# EAGLE design encoder with leds v1 (EAGLE 5.02)
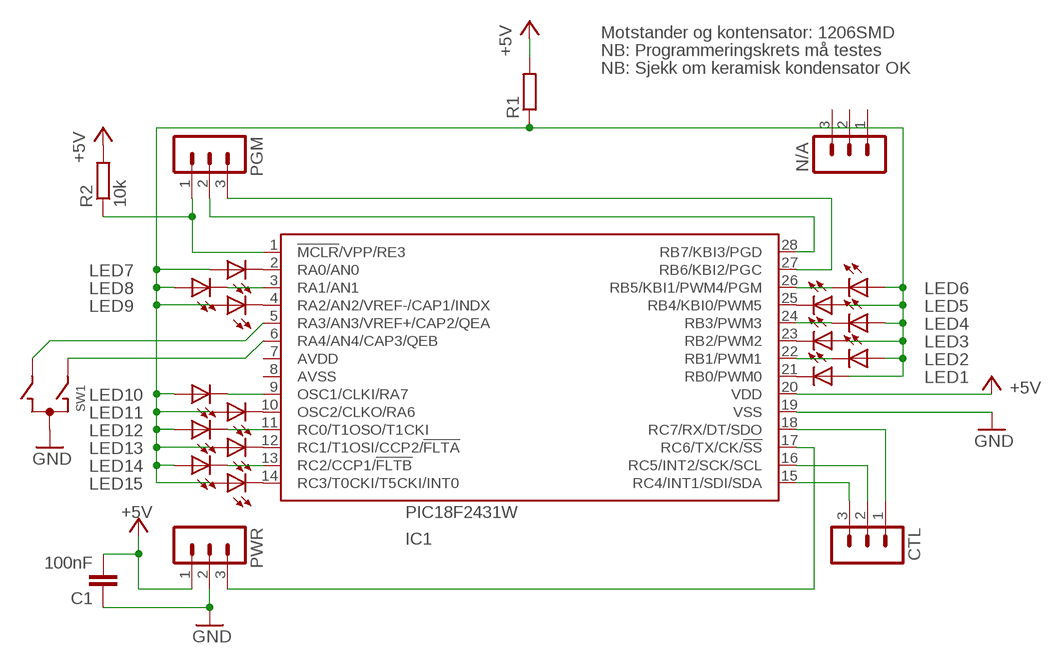
[diagram p0: schematic, sheet 1]

## Parts
C1  100nF  C-EUC1206  [C1206]
CTL  MA03-1  [MA03-1]
IC1  PIC18F2431W  [SO28W]
LED1  LED  [LED2X4]
LED2  LED  [LED2X4]
LED3  LED  [LED2X4]
LED4  LED  [LED2X4]
LED5  LED  [LED2X4]
LED6  LED  [LED2X4]
LED7  LED  [LED2X4]
LED8  LED  [LED2X4]
LED9  LED  [LED2X4]
LED10  LED  [LED2X4]
LED11  LED  [LED2X4]
LED12  LED  [LED2X4]
LED13  LED  [LED2X4]
LED14  LED  [LED2X4]
LED15  LED  [LED2X4]
N/A  MA03-1  [MA03-1]
PGM  MA03-1  [MA03-1]
PWR  MA03-1  [MA03-1]
R1  R-EU_R1206  [R1206]
R2  10k  R-EU_R1206  [R1206]
SW1  EC12E  [ALPS_EC12E]

## Nets
+5V: C1.2 IC1.20(VDD) PWR.1 R1.2 R2.2
GND: C1.1 IC1.19(VSS) PWR.2 SW1.C
N$1: IC1.21(RB0/PWM0) LED1.CATHODE(C)
N$2: IC1.10(OSC2/CLKO/RA6) LED11.CATHODE(C)
N$3: IC1.4(RA2/AN2/VREF-/CAP1/INDX) LED9.CATHODE(C)
N$4: IC1.9(OSC1/CLKI/RA7) LED10.CATHODE(C)
N$5: IC1.11(RC0/T1OSO/T1CKI) LED12.CATHODE(C)
N$6: IC1.12(RC1/T1OSI/CCP2/!FLTA) LED13.CATHODE(C)
N$7: IC1.13(RC2/CCP1/!FLTB) LED14.CATHODE(C)
N$8: IC1.14(RC3/T0CKI/T5CKI/INT0) LED15.CATHODE(C)
N$9: IC1.22(RB1/PWM1) LED2.CATHODE(C)
N$10: IC1.26(RB5/KBI1/PWM4/PGM) LED6.CATHODE(C)
N$11: IC1.2(RA0/AN0) LED7.CATHODE(C)
N$12: IC1.3(RA1/AN1) LED8.CATHODE(C)
N$13: IC1.23(RB2/PWM2) LED3.CATHODE(C)
N$14: IC1.24(RB3/PWM3) LED4.CATHODE(C)
N$15: IC1.25(RB4/KBI0/PWM5) LED5.CATHODE(C)
N$16: LED1.ANODE(A) LED2.ANODE(A) LED3.ANODE(A) LED4.ANODE(A) LED5.ANODE(A) LED6.ANODE(A) LED7.ANODE(A) LED8.ANODE(A) LED9.ANODE(A) LED10.ANODE(A) LED11.ANODE(A) LED12.ANODE(A) LED13.ANODE(A) LED14.ANODE(A) LED15.ANODE(A) R1.1
N$17: IC1.6(RA4/AN4/CAP3/QEB) SW1.A
N$18: IC1.5(RA3/AN3/VREF+/CAP2/QEA) SW1.B
N$19: CTL.3 IC1.15(RC4/INT1/SDI/SDA)
N$20: IC1.17(RC6/TX/CK/!SS) PWR.3
N$21: CTL.2 IC1.16(RC5/INT2/SCK/SCL)
N$22: CTL.1 IC1.18(RC7/RX/DT/SDO)
N$23: IC1.1(!MCLR!/VPP/RE3) PGM.1 R2.1
N$24: IC1.28(RB7/KBI3/PGD) PGM.2
N$25: IC1.27(RB6/KBI2/PGC) PGM.3
Unconnected: IC1.7(AVDD) IC1.8(AVSS) N/A.1 N/A.2 N/A.3 SW1.GND1(G) SW1.GND2(G)

## Notes on the sheet
- Motstander og kontensator: 1206SMD
- NB: Programmeringskrets må testes
- NB: Sjekk om keramisk kondensator OK

## Library data of the parts
C1 = rcl:C-EU: CAPACITOR, European symbol
CTL N/A PGM PWR = con-lstb:MA03-1: PIN HEADER
IC1 = joakim:PIC18F2*31: Flash Microcontroller with nanoWatt Technology High-Performance PWM and A/D, 28-Pin Source: http://ww1.microchip.com/downloads/en/DeviceDoc/39616C.pdf
LED1-LED15 = joakim:LED: LED Everlight: rectangular 2 x 4 mm, 594
R1 R2 = resistor:R-EU_: RESISTOR, European symbol
SW1 = joakim:EC12E: ALPS rotary Encoder EC12E series

## Board
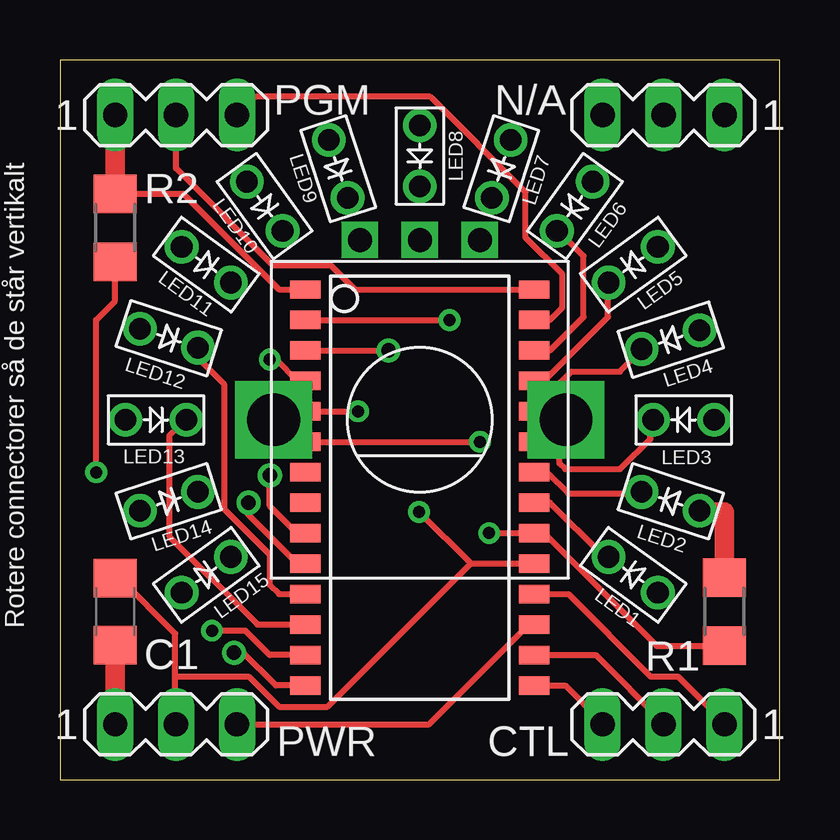
[diagram p1: board, top side]
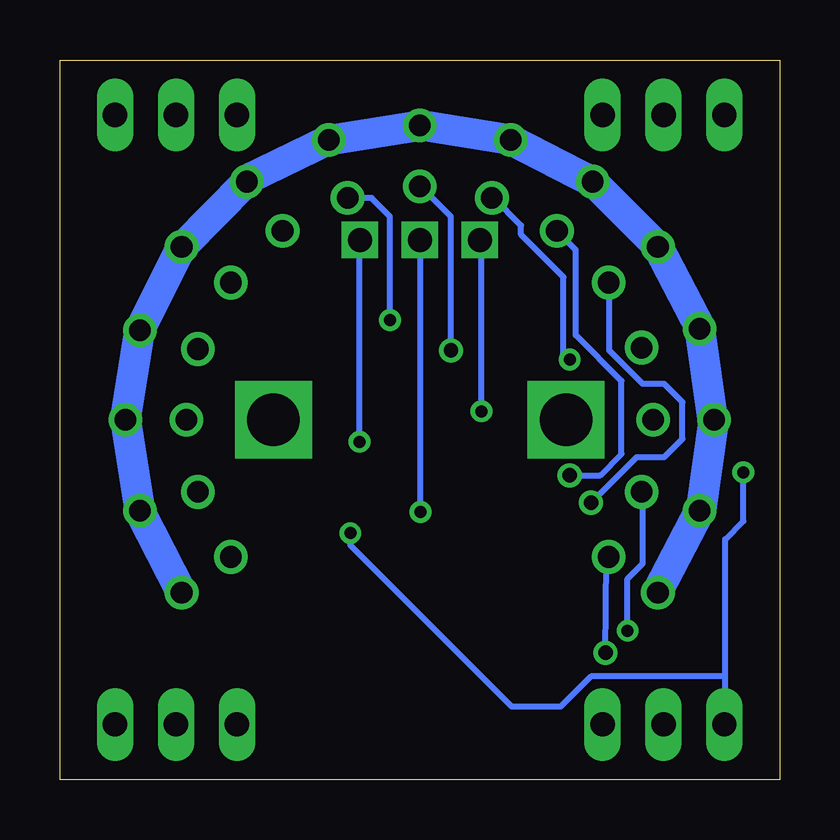
[diagram p2: board, bottom side, seen from below]

Size 30 x 30 mm. Coordinates in mm from the lower left corner, seen from the top.
Outline: 0,0 30,0 30,30 0,30 0,0
Copper layers (1*16): Top 0.035mm / dielectric 1.5mm / Bottom 0.035mm
Design rules "default": minimum track width 10mil, minimum drill 24mil, track to track 8mil, track to pad 8mil, pad to pad 8mil, via to via 8mil, smd to smd 8mil, copper to edge 40mil, drill to drill 8mil, minimum pad ring 10mil, minimum via ring 8mil, stop-mask expansion 4mil, vias tented up to drill 0mil, thermal gap 10mil

### Footprints (pad centres in the part's own frame; a part is rotated, then mirrored left to right if it is on the bottom)
C1206 = smd 1.6 x 1.8: 1 -1.4,0; 2 1.4,0
MA03-1 = drill 1.016 long: 1 -2.54,0; 2 0,0; 3 2.54,0
SO28W = smd 0.762 x 1.27: 1 -7.62,-4.78; 2 -6.35,-4.78; 3 -5.08,-4.78; 4 -3.81,-4.78; 5 -2.54,-4.78; 6 -1.27,-4.78; 7 0,-4.78; 8 1.27,-4.78; 9 2.54,-4.78; 10 3.81,-4.78; 11 5.08,-4.78; 12 6.35,-4.78; 13 7.62,-4.78; 14 8.89,-4.78; 15 8.89,4.78; 16 7.62,4.78; 17 6.35,4.78; 18 5.08,4.78; 19 3.81,4.78; 20 2.54,4.78; 21 1.27,4.78; 22 0,4.78; 23 -1.27,4.78; 24 -2.54,4.78; 25 -3.81,4.78; 26 -5.08,4.78; 27 -6.35,4.78; 28 -7.62,4.78
LED2X4 = drill 0.9 round: ANODE -1.27,0; CATHODE 1.27,0
R1206 = smd 1.6 x 1.803: 1 -1.422,0; 2 1.422,0
ALPS_EC12E = drill 1 square: A -2.5,-7.5; B 2.5,-7.5; C 0,-7.5 | drill 2.2 square: GND1 -6.1,0; GND2 6.1,0

### Placement (x,y rotation side)
C1  2.3,7 270 top
CTL  25.16,2.3 180 top
IC1  15,12.81 270 top
LED1  23.9,8.53 144 top
LED2  25.46,11.6 162 top
LED3  26,15 180 top
LED4  25.46,18.34 198 top
LED5  23.9,21.47 216 top
LED6  21.47,23.9 234 top
LED7  18.4,25.46 252 top
LED8  15,26 270 top
LED9  11.6,25.46 288 top
LED10  8.53,23.9 306 top
LED11  6.1,21.47 324 top
LED12  4.54,18.4 342 top
LED13  4,15 0 top
LED14  4.54,11.6 18 top
LED15  6.1,8.53 36 top
N/A  25.16,27.7 180 top
PGM  4.84,27.7 0 top
PWR  4.84,2.3 0 top
R1  27.7,7 270 top
R2  2.3,23 270 top
SW1  15,15 180 top

### Tracks (layer width: path | path; a pad name or v marks a point on that pad's centre or on a via)
+5V  (via drill 0.5)
  Top 0.254: R1.2 27.68,5.58 27.67,5.57 24.88,5.57 20.18,10.27 IC1.20 v17.89,10.27 | R2.2 2.3,19.95 1.51,19.16 v1.51,12.81
  Top 0.813: PWR.1 2.3,2.27 | 2.3,2.27 C1.2 | 2.3,2.27 2.27,2.27
  Bottom 0.254: v1.51,12.81 1.51,10.78 2.27,10.02 2.27,4.3 | PWR.1 2.27,2.27 2.27,4.3 | v17.89,10.27 17.89,9.76 11.16,3.03 9.13,3.03 7.86,4.3 2.27,4.3
GND  (via drill 0.5)
  Top 0.254: 19.91,9.13 IC1.19 17.13,9 | C1.1 2.49,8.4 4.81,6.08 4.81,4.3 | PWR.2 4.81,2.27 4.81,4.3 | 17.13,9 11.16,3.03 9.13,3.03 7.86,4.3 4.81,4.3 | 17.13,9 v14.97,11.16
  Bottom 0.254: SW1.C 14.97,22.46 v14.97,11.16
N$1
  Top 0.254: LED1.CATHODE 22.62,9.35 20.43,11.54 IC1.21
N$2  (via drill 0.6)
  Top 0.254: IC1.10 9.89,9 7.86,11.03 v7.86,11.54
  Bottom 0.254: v7.86,11.54 5.95,13.45 4.81,13.45 4.05,14.21 4.05,15.73 4.81,16.49 5.7,16.49 7.1,17.89 7.1,20.68 LED11.CATHODE
N$3  (via drill 0.5)
  Top 0.254: v8.75,17.51 9,17.51 9.89,16.62 IC1.4
  Bottom 0.254: v8.75,17.51 9,17.76 9,20.94 10.78,22.72 10.78,23.1 11.94,24.25 LED9.CATHODE
N$4  (via drill 0.6)
  Top 0.254: IC1.9 10.02,10.14 8.75,11.41 v8.75,12.68
  Bottom 0.254: v8.75,12.68 7.48,12.68 6.59,13.57 6.59,16.62 8.49,18.53 8.49,22.08 LED10.CATHODE
N$5
  Top 0.254: LED12.CATHODE 5.75,17.59 6.84,16.49 6.84,11.29 8.75,9.38 8.75,8.11 9.13,7.73 IC1.11
N$6
  Top 0.254: LED13.CATHODE 5.27,15.02 4.56,14.34 4.56,10.14 8.24,6.46 IC1.12
N$7  (via drill 0.5)
  Top 0.254: IC1.13 8.75,5.19 7.73,6.21 v6.33,6.21
  Bottom 0.254: v6.33,6.21 6.33,8.37 5.7,9 5.7,12.05 LED14.CATHODE
N$8  (via drill 0.6)
  Top 0.254: 10.14,3.92 IC1.14 10.4,3.87 10.14,3.92 | 10.14,3.92 10.02,3.92 | 10.14,3.92 9,3.92 7.6,5.32 v7.25,5.29
  Bottom 0.254: v7.25,5.29 7.22,9.13 7.1,9.25 LED15.CATHODE
N$9
  Top 0.254: IC1.22 20.3,12.81 21.19,11.92 24.18,11.92 LED2.CATHODE
N$10
  Top 0.254: IC1.26 20.43,17.89 21.83,19.29 21.83,21.83 20.79,22.87 LED6.CATHODE
N$11  (via drill 0.5)
  Top 0.254: IC1.2 v16.24,19.16
  Bottom 0.254: v16.24,19.16 16.24,23.48 17,24.24 LED7.CATHODE
N$12  (via drill 0.6)
  Top 0.254: IC1.3 v13.7,17.89
  Bottom 0.254: LED8.CATHODE 14.97,24.75 13.7,23.48 v13.7,17.89
N$13
  Top 0.254: IC1.23 20.3,14.08 20.81,13.57 20.81,13.19 21.07,12.94 23.35,12.94 24.62,14.21 24.62,14.97 24.7,14.97 LED3.CATHODE
N$14
  Top 0.254: 19.67,15.35 IC1.24 19.78,15.37 19.8,15.35 20.3,15.35 20.81,15.86 20.81,16.49 21.32,17 23.35,17 24.3,17.95 | 24.3,17.95 24.37,18.02 | 24.3,17.95 LED4.CATHODE
N$15
  Top 0.254: IC1.25 20.18,16.62 22.84,19.29 22.84,20.81 22.87,20.79 LED5.CATHODE
N$16
  Top 0.813: 26.7,11.2 LED2.ANODE 26.67,11.16 | 26.67,11.16 26.65,11.16 | R1.1 27.7,11.16 26.67,11.16
  Bottom 1.27: 26.65,11.16 LED3.ANODE 27.29,14.97 LED4.ANODE 26.65,18.78 LED5.ANODE 24.88,22.21 LED6.ANODE 22.21,25 LED7.ANODE 18.78,26.65 LED8.ANODE 14.97,27.29 LED9.ANODE 7.73,24.88 LED10.ANODE LED11.ANODE 3.29,18.78 LED12.ANODE 2.78,14.97 LED13.ANODE 3.29,11.16 LED14.ANODE 5.06,7.86 LED15.ANODE | 26.65,11.16 LED2.ANODE | 26.65,11.16 LED1.ANODE
N$17  (via drill 0.5)
  Top 0.254: IC1.6 v17.51,14.08
  Bottom 0.254: SW1.A 17.5,22.47 17.51,22.46 v17.51,14.08
N$18  (via drill 0.5)
  Top 0.254: IC1.5 v12.43,15.35
  Bottom 0.254: SW1.B 12.47,22.5 12.43,22.46 v12.43,15.35
N$19
  Top 0.254: CTL.3 22.62,2.37 21.07,3.92 IC1.15
N$20
  Top 0.254: 19.8,6.33 19.8,6.45 IC1.17 19.54,6.46 15.38,2.3 PWR.3
N$21
  Top 0.254: CTL.2 25.16,2.37 22.34,5.19 IC1.16
N$22
  Top 0.254: IC1.18 21.19,7.73 24.62,4.3 25.77,4.3 27.77,2.3 | 27.8,2.27 27.77,2.3 | 27.77,2.3 CTL.1
N$23
  Top 0.254: R2.1 5.14,24.42 9.13,20.43 IC1.1
  Top 0.813: 2.3,27.67 PGM.1 | R2.1 2.3,27.67 | 2.3,27.67 2.27,27.67
N$24
  Top 0.254: PGM.2 4.84,25.48 8.87,21.45 11.29,21.45 12.3,20.43 IC1.28 19.8,20.43
N$25
  Top 0.254: IC1.27 20.43,19.16 20.94,19.67 20.94,21.07 19.41,22.59 19.41,24.5 15.45,28.46 8.14,28.46 PGM.3 7.35,27.67

### Text on the board
tNames: Lage ny package til encoder | Rotere connectorer så de står vertikalt